# EAGLE design arduinoModuleLB (EAGLE 6.3)
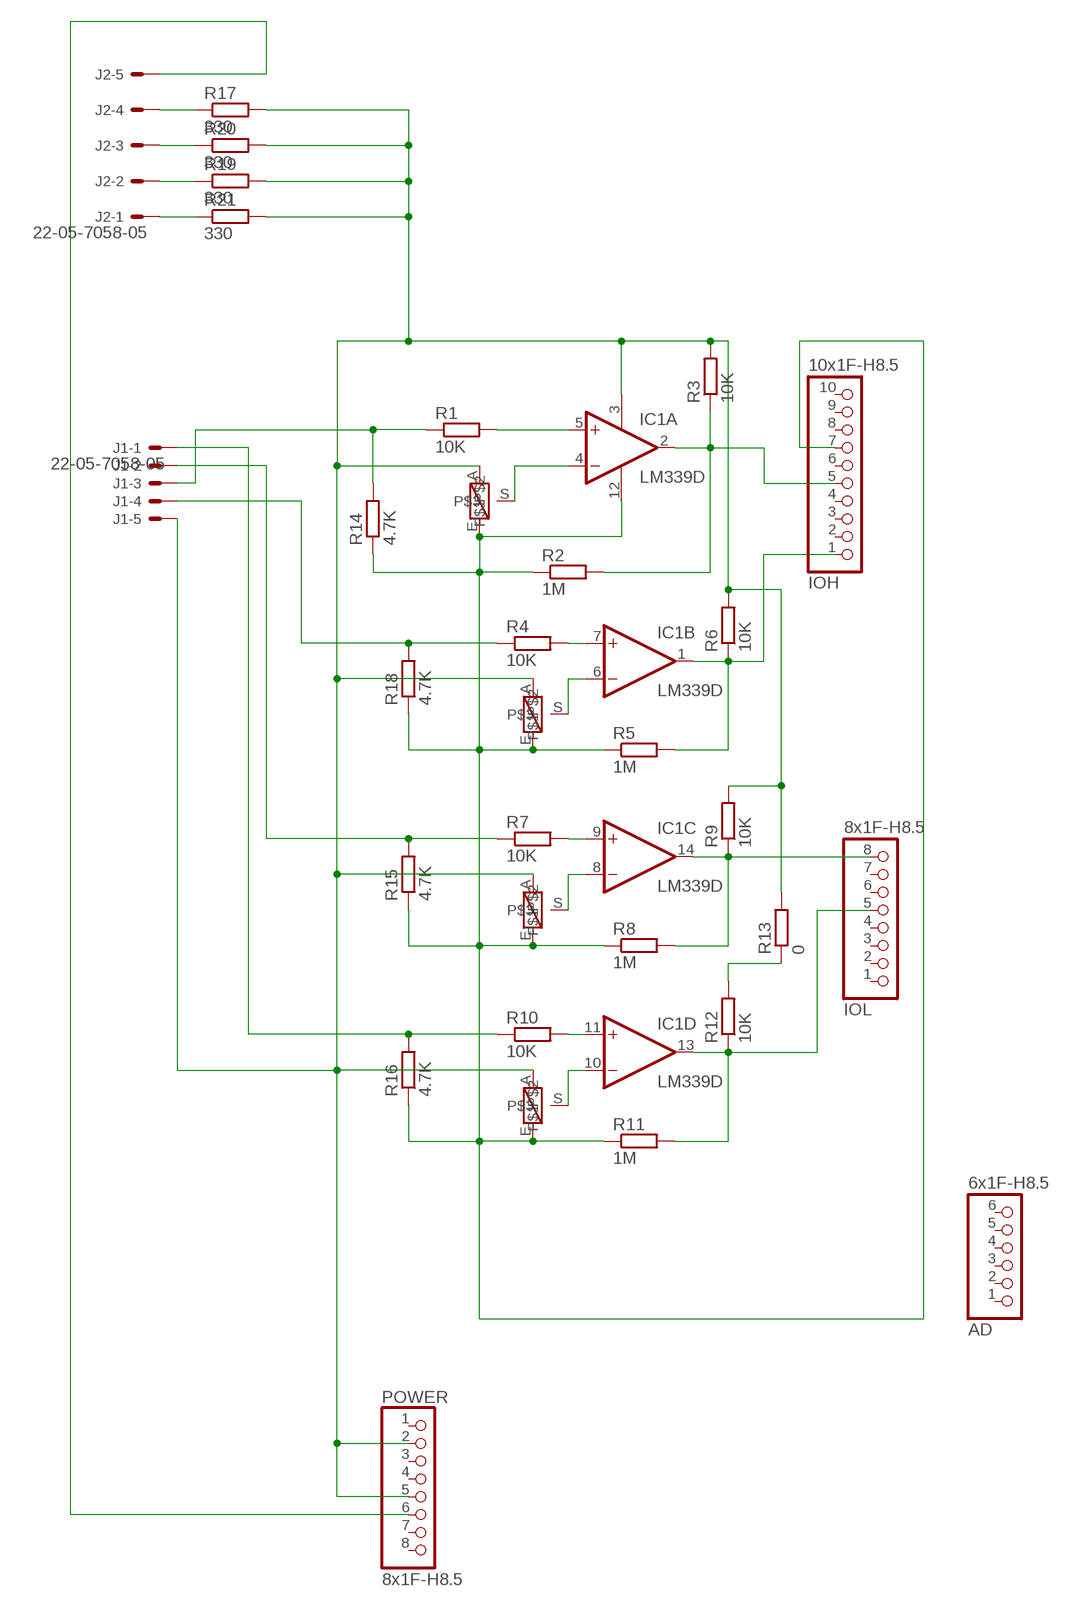
[diagram p0: schematic, sheet 1]

## Parts
AD  6x1F-H8.5  SMARTPRJ_PINHD-1X6  [SMARTPRJ_1X06]
IC1  LM339D  [SO14]
IOH  10x1F-H8.5  SMARTPRJ_PINHD-1X10_ARD  [SMARTPRJ_1X10]
IOL  8x1F-H8.5  SMARTPRJ_PINHD-1X8  [SMARTPRJ_1X08]
J1  22-05-7058-05  [7395-05]
J2  22-05-7058-05  [7395-05]
POWER  8x1F-H8.5  SMARTPRJ_PINHD-1X8  [SMARTPRJ_1X08]
R1  10K  R-EU_R0603  [R0603]
R2  1M  R-EU_R0603  [R0603]
R3  10K  R-EU_R0603  [R0603]
R4  10K  R-EU_R0603  [R0603]
R5  1M  R-EU_R0603  [R0603]
R6  10K  R-EU_R0603  [R0603]
R7  10K  R-EU_R0603  [R0603]
R8  1M  R-EU_R0603  [R0603]
R9  10K  R-EU_R0603  [R0603]
R10  10K  R-EU_R0603  [R0603]
R11  1M  R-EU_R0603  [R0603]
R12  10K  R-EU_R0603  [R0603]
R13  0  R-EU_0207/10  [0207/10]
R14  4.7K  R-EU_0207/10  [0207/10]
R15  4.7K  R-EU_0207/10  [0207/10]
R16  4.7K  R-EU_0207/10  [0207/10]
R17  330  R-EU_R0603  [R0603]
R18  4.7K  R-EU_0207/10  [0207/10]
R19  330  R-EU_R0603  [R0603]
R20  330  R-EU_R0603  [R0603]
R21  330  R-EU_R0603  [R0603]
U$3  M64P103KB40  [M64P]
U$4  M64P103KB40  [M64P]
U$5  M64P103KB40  [M64P]
U$6  M64P103KB40  [M64P]

## Nets
5V: IC1.3(P:V+) J1.5 POWER.2 POWER.5 R3.2 R6.2 R9.2 R13.2 R17.2 R19.2 R20.2 R21.2 U$3.A U$4.A U$5.A U$6.A
GND: IC1.12(P:GND) IOH.7 R2.1 R5.1 R8.1 R11.1 R14.1 R15.1 R16.1 R18.1 U$3.E U$4.E U$5.E U$6.E
N$1: IC1.4(A:-IN) U$4.S
N$2: IC1.5(A:+IN) R1.2
N$3: IC1.2(A:OUT) IOH.5 R2.2 R3.1
N$4: J1.3 R1.1 R14.2
N$5: IC1.7(B:+IN) R4.2
N$6: IC1.6(B:-IN) U$3.S
N$7: IC1.1(B:OUT) IOH.1 R5.2 R6.1
N$8: J1.4 R4.1 R18.2
N$9: IC1.8(C:-IN) U$5.S
N$10: IC1.14(C:OUT) IOL.8 R8.2 R9.1
N$11: IC1.10(D:-IN) U$6.S
N$12: J1.2 R7.1 R15.2
N$13: IC1.9(C:+IN) R7.2
N$14: IC1.13(D:OUT) IOL.5 R11.2 R12.1
N$15: J1.1 R10.1 R16.2
N$16: R12.2 R13.1
N$17: IC1.11(D:+IN) R10.2
N$18: J2.4 R17.1
N$19: J2.3 R20.1
N$20: J2.2 R19.1
N$21: J2.1 R21.1
N$22: J2.5 POWER.6
Unconnected: AD.1 AD.2 AD.3 AD.4 AD.5 AD.6 IOH.2 IOH.3 IOH.4 IOH.6 IOH.8 IOH.9 IOH.10 IOL.1 IOL.2 IOL.3 IOL.4 IOL.6 IOL.7 POWER.1 POWER.3 POWER.4 POWER.7 POWER.8

## Library data of the parts
AD = arduinoModuleSVS:SMARTPRJ_PINHD-1X6: PIN HEADER
IC1 = linear:LM339: Low Power Low Offset Voltage Quad Comparators with open collector; LM139/LM239/LM339/LM2901/LM3302
IOH = arduinoModuleSVS:SMARTPRJ_PINHD-1X10_ARD: PIN HEADER
IOL POWER = arduinoModuleSVS:SMARTPRJ_PINHD-1X8: PIN HEADER
J1 J2 = con-molex:22-?-05: CONNECTOR wire to board 2.54 mm (.1 inch) pitch header; OC_FARNELL: unknown; OC_NEWARK: unknown
R1-R21 = resistor:R-EU_: RESISTOR, European symbol
U$3-U$6 = wingX:M64P103KB40

## Net classes
0 default: width 0.254 mm, clearance 0.254 mm
1 power: width 0.61 mm, drill 0.61 mm, clearance 0.254 mm
2 gnd: width 0.305 mm, drill 0.559 mm, clearance 0.254 mm
3 usbvcc: width 0.508 mm, drill 0.61 mm, clearance 0.254 mm
4 aref: width 0.406 mm, drill 0.61 mm, clearance 0.254 mm

## Board
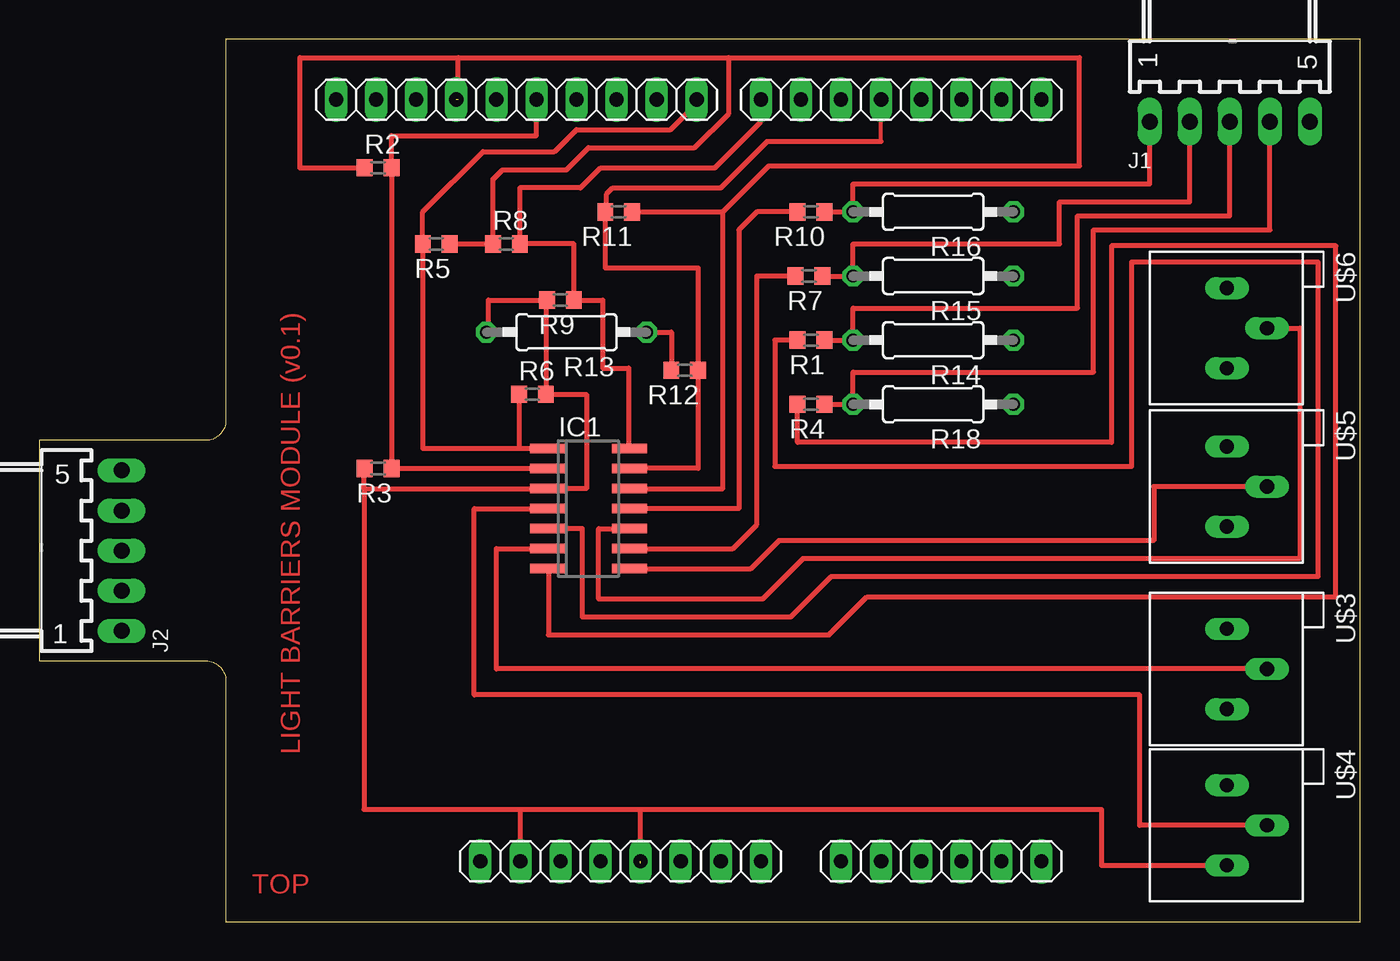
[diagram p1: board, top side]
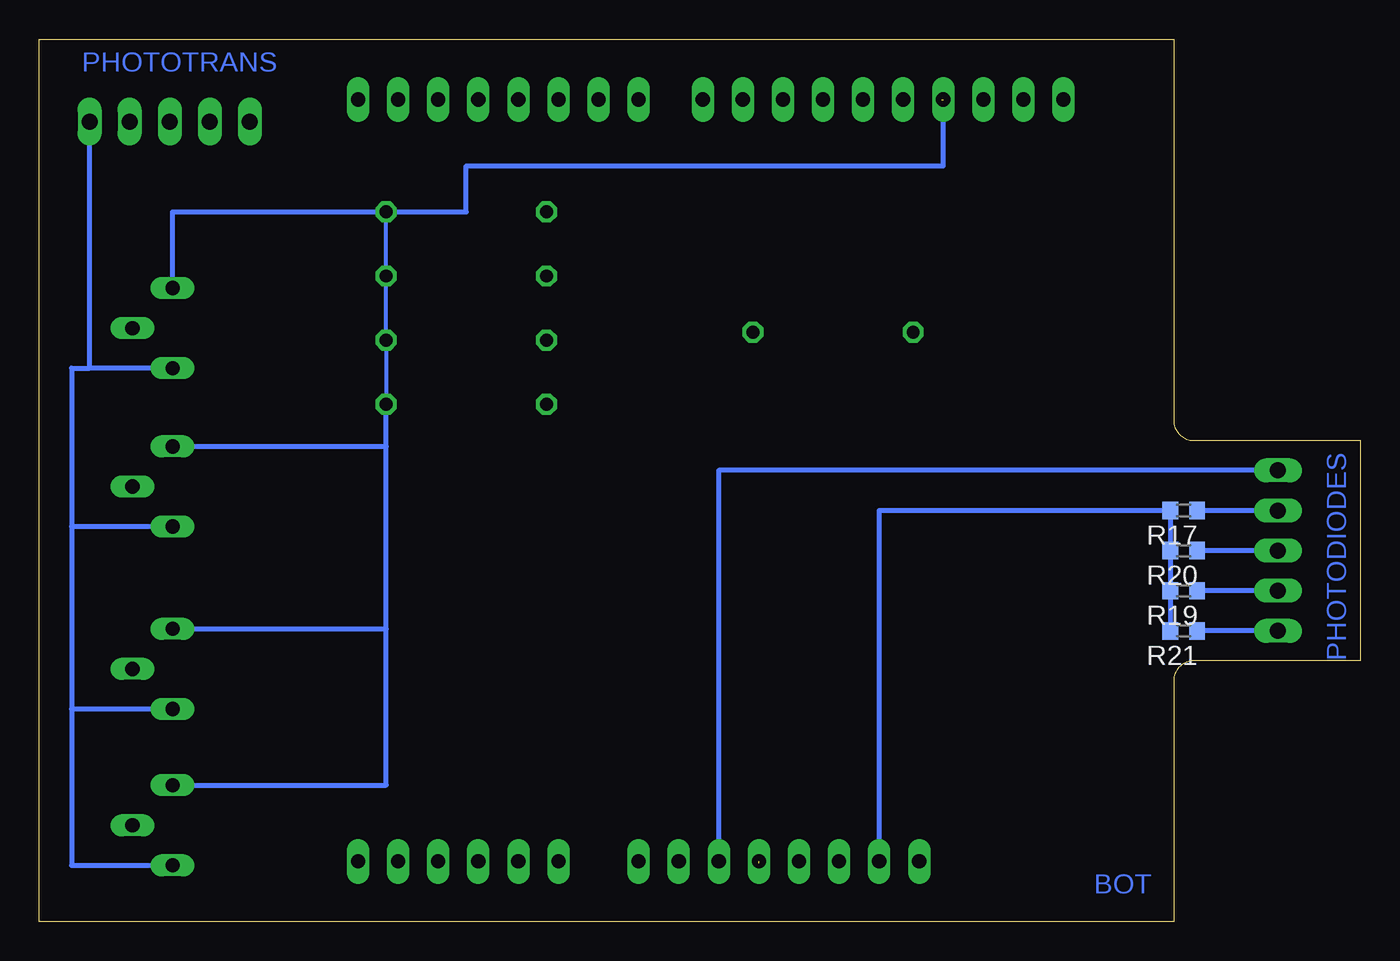
[diagram p2: board, bottom side, seen from below]

Size 83.69 x 55.88 mm. Coordinates in mm from the lower left corner, seen from the top.
Outline: 83.69,0 83.69,55.88 11.81,55.88 11.81,31.75 arc-90 10.54,30.48 0,30.48 0,16.51 10.54,16.51 arc-90 11.81,15.24 11.81,0 83.69,0
Copper layers (1*16): Top 0.035mm / dielectric 1.5mm / Bottom 0.035mm
Design rules "default *": minimum track width 10mil, minimum drill 22mil, track to track 1mm, track to pad 1mm, pad to pad 1mm, via to via 1mm, smd to smd 1mm, copper to edge 26mil, drill to drill 8mil, minimum pad ring 10mil, minimum via ring 10mil, stop-mask expansion 4mil, vias tented up to drill 0mil, thermal gap 50mil

### Footprints (pad centres in the part's own frame; a part is rotated, then mirrored left to right if it is on the bottom)
SMARTPRJ_1X06 = drill 0.9 pad 1.422 long: 1 -6.35,0; 2 -3.81,0; 3 -1.27,0; 4 1.27,0; 5 3.81,0; 6 6.35,0
SO14 = smd 0.6 x 2.2: 1 -3.81,-2.6; 2 -2.54,-2.6; 3 -1.27,-2.6; 4 0,-2.6; 5 1.27,-2.6; 6 2.54,-2.6; 7 3.81,-2.6; 8 3.81,2.6; 9 2.54,2.6; 10 1.27,2.6; 11 0,2.6; 12 -1.27,2.6; 13 -2.54,2.6; 14 -3.81,2.6
SMARTPRJ_1X10 = drill 0.9 pad 1.422 long: 1 -11.43,0; 2 -8.89,0; 3 -6.35,0; 4 -3.81,0; 5 -1.27,0; 6 1.27,0; 7 3.81,0; 8 6.35,0; 9 8.89,0; 10 11.43,0
SMARTPRJ_1X08 = drill 0.9 pad 1.422 long: 1 -8.89,0; 2 -6.35,0; 3 -3.81,0; 4 -1.27,0; 5 1.27,0; 6 3.81,0; 7 6.35,0; 8 8.89,0
7395-05 = drill 1.016 long: 1 5.08,0; 2 2.54,0; 3 0,0; 4 -2.54,0; 5 -5.08,0
R0603 = smd 1 x 1.1: 1 -0.85,0; 2 0.85,0
0207/10 = drill 0.813 octagon: 1 -5.08,0; 2 5.08,0
M64P = drill 0.9 long: A 2.54,4.9; E -2.54,4.9; S 0,7.44

### Placement (x,y rotation side)
AD  57.15,3.81 0 top
IC1  34.8,26.16 270 top
IOH  30.23,52.07 180 top
IOL  54.61,52.07 180 top
J1  75.44,50.67 180 top
J2  5.21,23.5 270 top
POWER  36.83,3.81 0 top
R1  48.9,36.83 180 top
R2  21.46,47.75 0 top
R3  21.46,28.7 180 top
R4  48.9,32.77 180 top
R5  25.15,42.93 180 top
R6  31.24,33.4 0 top
R7  48.77,40.89 180 top
R8  29.59,42.93 0 top
R9  33.02,39.37 180 top
R10  48.9,44.96 180 top
R11  36.7,44.96 180 top
R12  40.89,34.93 180 top
R13  33.4,37.34 180 top
R14  56.64,36.83 180 top
R15  56.64,40.89 180 top
R16  56.64,44.96 180 top
R17  11.18,26.04 180 bottom
R18  56.64,32.77 180 top
R19  11.18,20.95 180 bottom
R20  11.18,23.5 180 bottom
R21  11.18,18.41 180 bottom
U$3  70.36,16 270 top
U$4  70.36,6.1 270 top
U$5  70.36,27.56 270 top
U$6  70.36,37.59 270 top

### Tracks (layer width: path | path; a pad name or v marks a point on that pad's centre or on a via)
5V  (1 unrouted)
  Top 0.254: 20.57,28.7 R3.2 | R13.2 28.32,37.08 28.45,37.08 | R9.2 32.09,39.37
  Top 0.305: 20.57,27.43 IC1.3 34.67,27.43 34.67,33.4 R6.2 32.09,39.37 | 20.57,27.43 20.57,28.7 | 38.1,3.68 38.1,7.11 | 38.1,7.11 67.31,7.11 67.31,3.56 U$4.A | 28.45,37.08 28.45,39.37 R9.2 | POWER.2 30.48,7.11 | 30.48,7.11 38.1,7.11 | 20.57,27.43 20.57,7.11 30.48,7.11
  Bottom 0.305: U$5.A 81.66,25.02 | 81.66,25.02 81.66,13.46 | 81.66,13.46 81.66,3.56 U$4.A | U$3.A 81.66,13.46 | U$6.A 80.52,35.05 | 81.66,25.02 81.66,35.05 80.52,35.05 | 80.52,35.05 J1.5 | POWER.2 30.48,26.04 R17.2 R20.2 R19.2 R21.2
GND  (1 unrouted)
  Top 0.305: 26.54,54.74 43.69,54.74 | 43.69,54.74 65.91,54.74 65.91,47.88 46.23,47.88 43.31,44.96 | 26.54,52.07 26.54,54.74 | R11.1 43.31,44.96 | IC1.12 43.31,27.43 43.31,44.96 | 43.69,54.74 43.69,51.18 41.53,49.02 34.8,49.02 33.4,47.62 29.34,47.62 28.74,47.03 R8.1 R5.1 | 26.54,54.74 16.51,54.74 16.51,47.75 R2.1
  Bottom 0.254: R18.1 R14.1 R15.1 R16.1
  Bottom 0.305: IOH.7 26.42,47.88 56.64,47.88 56.64,44.96 R16.1 75.26,44.96 U$6.E | U$4.E 61.72,8.64 61.72,18.54 | 61.72,18.54 61.72,30.1 | 61.72,30.1 R18.1 | U$3.E 61.72,18.54 | U$5.E 61.72,30.1
N$1
  Top 0.305: U$4.S 69.72,6.1 69.72,14.35 27.56,14.35 27.56,26.16 IC1.4
N$2
  Top 0.305: R1.2 46.61,36.83 46.61,28.83 69.22,28.83 69.22,41.78 81.03,41.78 81.03,21.84 50.16,21.84 47.62,19.3 34.42,19.3 34.42,24.89 IC1.5
N$3
  Top 0.305: IC1.2 R3.1 R2.2 22.31,49.78 31.5,49.78 IOH.5
N$4
  Top 0.305: R1.1 R14.2 51.56,38.86 65.79,38.86 65.79,44.7 75.44,44.7 J1.3
N$5
  Top 0.254: IC1.7 32.26,22.35
  Top 0.305: 32.26,22.35 32.26,18.16 50.04,18.16 52.45,20.57 82.17,20.57 82.17,42.8 67.94,42.8 67.94,30.35 48.05,30.35 R4.2
N$6
  Top 0.305: U$3.S 28.96,16 28.96,23.62 IC1.6
N$7
  Top 0.305: 30.39,29.97 24.3,29.97 R5.2 24.3,44.96 28.11,48.77 32.64,48.77 34.04,50.17 40.01,50.17 41.66,51.82 IOH.1 | 30.39,29.97 IC1.1 | R6.1 30.39,29.97
N$8
  Top 0.305: R4.1 R18.2 51.56,34.8 66.8,34.8 66.8,43.82 77.98,43.82 J1.4
N$9
  Top 0.305: U$5.S 70.61,27.56 70.61,24.13 46.86,24.13 45.09,22.35 IC1.8
N$10
  Top 0.254: 37.34,30.03 IC1.14
  Top 0.305: 37.34,30.03 37.34,35.05 35.69,35.05 35.69,39.37 R9.1 33.87,42.93 R8.2 30.44,46.48 34.29,46.48 35.56,47.75 42.8,47.75 45.72,50.67 IOL.8
N$11
  Top 0.305: U$6.S 79.88,37.59 79.88,22.99 48.39,22.99 45.85,20.45 35.43,20.45 35.43,24.89 IC1.10
N$12
  Top 0.305: R7.1 R15.2 51.56,42.93 64.64,42.93 64.64,45.59 72.9,45.59 J1.2
N$13
  Top 0.305: R7.2 45.47,40.89 45.47,25.15 43.94,23.62 IC1.9
N$14
  Top 0.254: 53.38,52.03 IOL.5 53.34,49.4 | 35.94,44.96 R11.2
  Top 0.305: 53.34,49.4 46.1,49.4 43.18,46.48 36.32,46.48 35.94,46.1 35.94,44.96 | IC1.13 41.74,28.7 R12.1 41.74,41.4 35.85,41.4 R11.2
N$15
  Top 0.305: R10.1 R16.2 51.56,46.74 70.36,46.74 J1.1
N$16
  Top 0.305: R13.1 40.04,37.34 R12.2
N$17
  Top 0.305: IC1.11 44.32,26.16 44.32,43.82 45.47,44.96 R10.2
N$18
  Bottom 0.305: J2.4 R17.1
N$19
  Bottom 0.305: J2.3 R20.1
N$20
  Bottom 0.305: J2.2 R19.1
N$21
  Bottom 0.305: J2.1 R21.1
N$22
  Bottom 0.305: J2.5 40.64,28.57 POWER.6

### Text on the board
Top: LIGHT BARRIERS MODULE (v0.1) | TOP
Bottom: PHOTOTRANS | PHOTODIODES | BOT
214bmp: D:/SmartProjects/Snc/a4_bn_logo2.bmp